# EAGLE design zerox_1.2 (EAGLE 6.5.0)
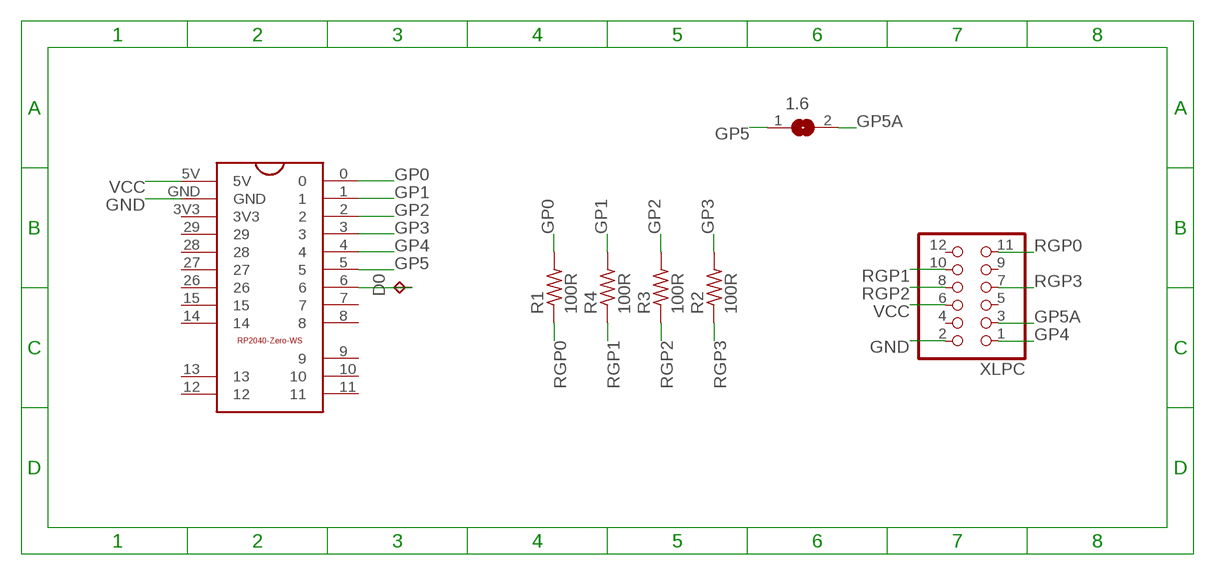
[diagram p0: schematic, sheet 1]

## Parts
1.6  SJ  [SJ]
D0  TPTP12SQ  [TP12SQ]
R1  100R  R-US_R0805  [R0805]
R2  100R  R-US_R0805  [R0805]
R3  100R  R-US_R0805  [R0805]
R4  100R  R-US_R0805  [R0805]
U$1  RPI2040-WS-SMD  [RPI2040-WS]
XLPC  PINHD-2X6  [2X06]

## Nets
GND: U$1.GND XLPC.2
GP0: R1.2 U$1.0
GP1: R4.2 U$1.1
GP2: R3.2 U$1.2
GP3: R2.2 U$1.3
GP4: U$1.4 XLPC.1
GP5: 1.6.1 U$1.5
GP5A: 1.6.2 XLPC.3
N$1: D0.TP U$1.6
RGP0: R1.1 XLPC.11
RGP1: R4.1 XLPC.10
RGP2: R3.1 XLPC.8
RGP3: R2.1 XLPC.7
VCC: U$1.5V XLPC.6
Unconnected: U$1.3V3 U$1.7 U$1.8 U$1.9 U$1.10 U$1.11 U$1.12 U$1.13 U$1.14 U$1.15 U$1.26 U$1.27 U$1.28 U$1.29 XLPC.4 XLPC.5 XLPC.9 XLPC.12

## Library data of the parts
1.6 = jumper:SJ: SMD solder JUMPER
D0 = testpad:TP: Test pad
R1-R4 = rcl:R-US_: RESISTOR, American symbol
U$1 = RPI-Zero-WS:RPI2040-WS
XLPC = pinhead:PINHD-2X6: PIN HEADER

## Board
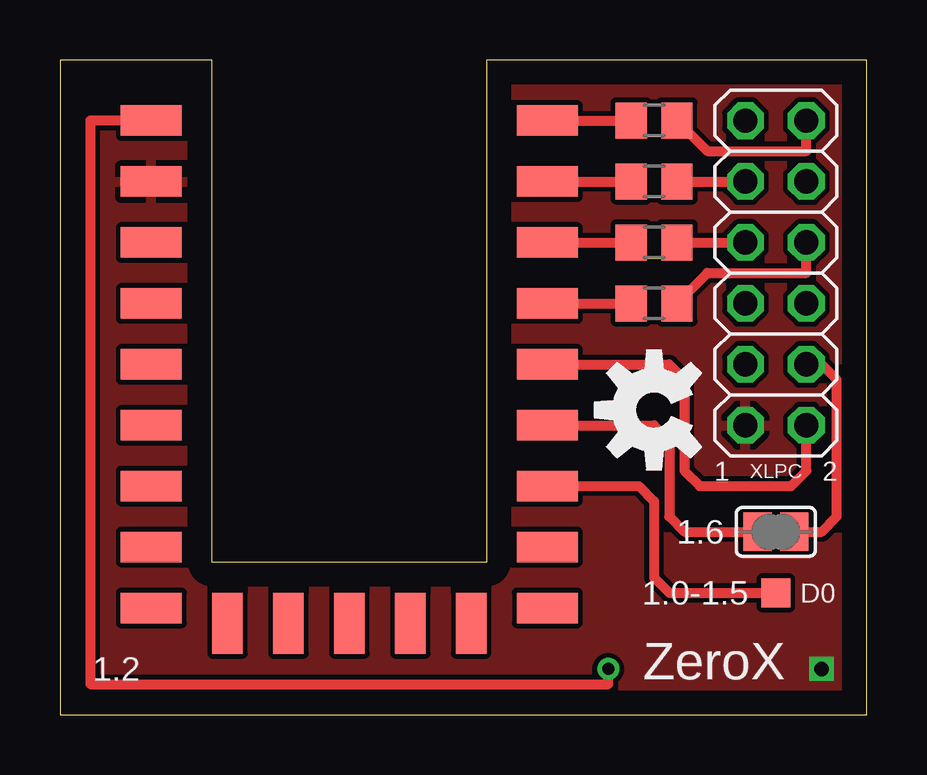
[diagram p1: board, top side]
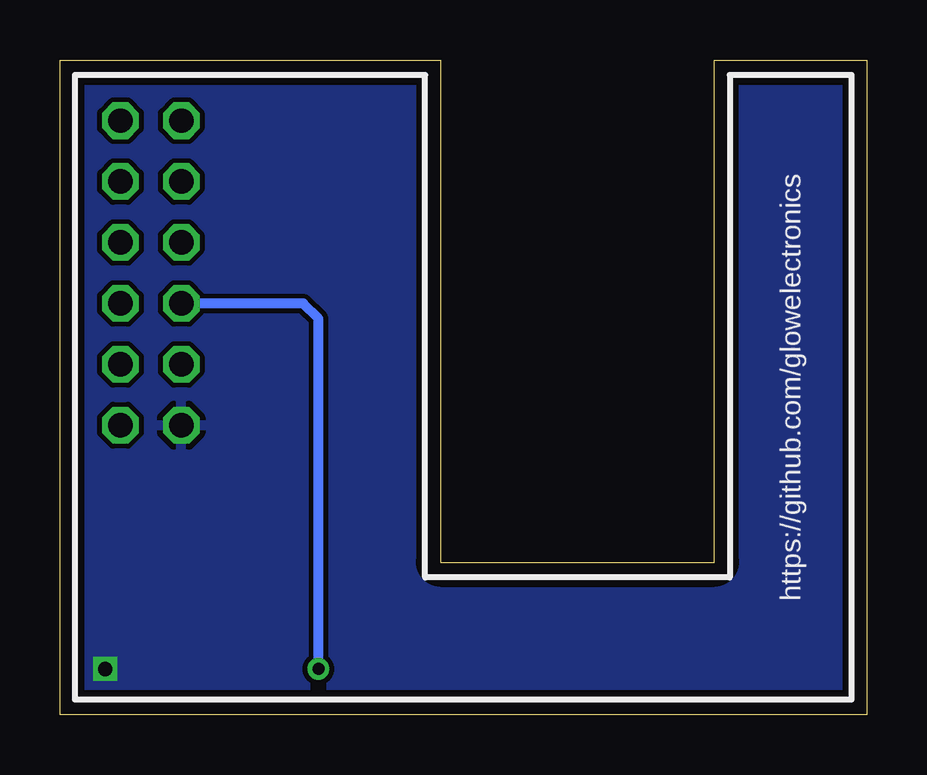
[diagram p2: board, bottom side, seen from below]

Size 33.63 x 27.3 mm. Coordinates in mm from the lower left corner, seen from the top.
Outline: 0,0 33.63,0 33.63,27.3 17.78,27.3 17.78,6.35 6.35,6.35 6.35,27.3 0,27.3 0,0
Copper layers (1*16): Top 0.035mm / dielectric 1.5mm / Bottom 0.035mm
Design rules "default": minimum track width 10mil, minimum drill 24mil, track to track 8mil, track to pad 8mil, pad to pad 8mil, via to via 8mil, smd to smd 8mil, copper to edge 40mil, drill to drill 8mil, minimum pad ring 10mil, minimum via ring 8mil, stop-mask expansion 4mil, vias tented up to drill 0mil, thermal gap 10mil

### Footprints (pad centres in the part's own frame; a part is rotated, then mirrored left to right if it is on the bottom)
SJ = smd 1.168 x 1.6: 1 -0.762,0; 2 0.762,0
TP12SQ = smd 1.2 x 1.2: TP 0,0
R0805 = smd 1.3 x 1.5: 1 -0.95,0; 2 0.95,0
RPI2040-WS = smd 2.54 x 1.27: 0 8.255,10.16; 1 8.255,7.62; 2 8.255,5.08; 3 8.255,2.54; 3V3 -8.255,5.08; 4 8.255,0; 5 8.255,-2.54; 5V -8.255,10.16; 6 8.255,-5.08; 7 8.255,-7.62; 8 8.255,-10.16; 14 -8.255,-10.16; 15 -8.255,-7.62; 26 -8.255,-5.08; 27 -8.255,-2.54; 28 -8.255,0; 29 -8.255,2.54; GND -8.255,7.62 | smd 1.27 x 2.54: 9 5.08,-10.795; 10 2.54,-10.795; 11 0,-10.795; 12 -2.54,-10.795; 13 -5.08,-10.795
2X06 = drill 1.016 octagon: 1 -6.35,-1.27; 2 -6.35,1.27; 3 -3.81,-1.27; 4 -3.81,1.27; 5 -1.27,-1.27; 6 -1.27,1.27; 7 1.27,-1.27; 8 1.27,1.27; 9 3.81,-1.27; 10 3.81,1.27; 11 6.35,-1.27; 12 6.35,1.27

### Placement (x,y rotation side)
1.6  29.84,7.62 0 top
D0  29.84,5.08 0 top
R1  24.77,24.77 180 top
R2  24.77,17.14 180 top
R3  24.77,19.68 180 top
R4  24.77,22.23 180 top
U$1  12.06,14.61 0 top
U$2  [OSHW-LOGO-M]  24.77,12.7 90 top
XLPC  29.84,18.41 90 top

### Tracks (layer width: path | path; a pad name or v marks a point on that pad's centre or on a via)
GND  (via drill 0.6)
  other vias: 31.75,1.91
  pour Top: 0,0 0,27.3 6.35,27.3 6.35,6.35 17.78,6.35 17.78,27.3 33.66,27.3 33.66,0
  pour Bottom: 0,0 0,27.3 6.35,27.3 6.35,6.35 17.78,6.35 17.78,27.3 33.66,27.3 33.66,0
GP0
  Top 0.406: U$1.0 R1.2
GP1
  Top 0.406: U$1.1 R4.2
GP2
  Top 0.406: U$1.2 R3.2
GP3
  Top 0.406: U$1.3 R2.2
GP4
  Top 0.406: U$1.4 25.4,14.61 26.04,13.97 26.04,10.16 26.67,9.53 30.48,9.53 31.11,10.16 XLPC.1
GP5
  Top 0.406: U$1.5 24.77,12.06 25.4,11.43 25.4,8.26 26.04,7.62 1.6.1
GP5A
  Top 0.406: 1.6.2 31.75,7.62 32.38,8.26 32.38,13.97 31.75,14.61 XLPC.3
N$1
  Top 0.406: U$1.6 24.13,9.53 24.77,8.89 24.77,5.71 25.4,5.08 D0.TP
RGP0
  Top 0.406: R1.1 26.98,23.5 31.11,23.5 XLPC.11
RGP1
  Top 0.406: R4.1 XLPC.10
RGP2
  Top 0.406: R3.1 XLPC.8
RGP3
  Top 0.406: R2.1 26.98,18.41 31.11,18.41 XLPC.7
VCC  (via drill 0.5)
  Top 0.406: U$1.5V 1.27,24.77 1.27,1.27 22.86,1.27 v22.86,1.91
  Bottom 0.406: v22.86,1.91 22.86,16.51 23.5,17.14 XLPC.6

### Text on the board
tNames: 1 | 2 | 1.0-1.5 | 1.2 | ZeroX
bNames: https://github.com/glowelectronics